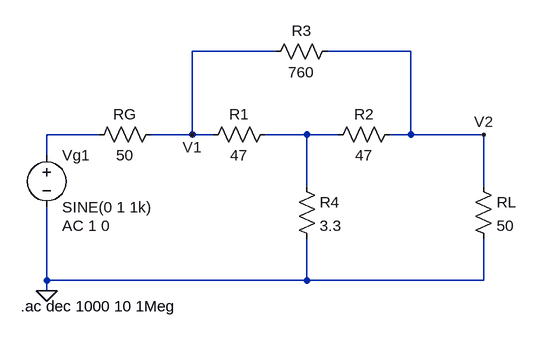
[diagram p0: schematic atenuador.asc]
atenuador.asc, the LTspice schematic file:
Version 4
SHEET 1 880 680
WIRE 448 -16 320 -16
WIRE 656 -16 528 -16
WIRE 176 112 96 112
WIRE 320 112 320 -16
WIRE 320 112 256 112
WIRE 352 112 320 112
WIRE 496 112 432 112
WIRE 544 112 496 112
WIRE 656 112 656 -16
WIRE 656 112 624 112
WIRE 768 112 656 112
WIRE 96 144 96 112
WIRE 496 192 496 112
WIRE 768 192 768 112
WIRE 96 336 96 224
WIRE 496 336 496 272
WIRE 496 336 96 336
WIRE 768 336 768 272
WIRE 768 336 496 336
WIRE 96 352 96 336
FLAG 96 352 0
FLAG 768 112 V2
FLAG 320 112 V1
SYMBOL voltage 96 128 R0
WINDOW 123 24 124 Left 2
WINDOW 39 0 0 Left 0
SYMATTR Value2 AC 1 0
SYMATTR InstName Vg1
SYMATTR Value SINE(0 1 1k)
SYMBOL res 272 96 R90
WINDOW 0 0 56 VBottom 2
WINDOW 3 32 56 VTop 2
SYMATTR InstName RG
SYMATTR Value 50
SYMBOL res 448 96 R90
WINDOW 0 0 56 VBottom 2
WINDOW 3 32 56 VTop 2
SYMATTR InstName R1
SYMATTR Value 47
SYMBOL res 640 96 R90
WINDOW 0 0 56 VBottom 2
WINDOW 3 32 56 VTop 2
SYMATTR InstName R2
SYMATTR Value 47
SYMBOL res 544 -32 R90
WINDOW 0 0 56 VBottom 2
WINDOW 3 32 56 VTop 2
SYMATTR InstName R3
SYMATTR Value 760
SYMBOL res 480 176 R0
SYMATTR InstName R4
SYMATTR Value 3.3
SYMBOL res 752 176 R0
SYMATTR InstName RL
SYMATTR Value 50
TEXT 56 376 Left 2 !.ac dec 1000 10 1Meg

The netlist it stands for:
* atenuador.asc
Vg1 N001 0 SINE(0 1 1k) AC 1 0
RG V1 N001 50
R1 N002 V1 47
R2 V2 N002 47
R3 V2 V1 760
R4 N002 0 3.3
RL V2 0 50
.ac dec 1000 10 1Meg
.backanno
.end